# Altium schematic sheet 601_USBHub-Grid-Part1.SchDoc: USB Hub Grid Connections Part 1
size A2; Organization: Greenfield Tech Solutions; Address1: Molendreef 33; Address2: Ossendrecht; Address3: 4641CS; Address4: The Netherlands; SheetNumber: 7; SheetTotal: 9
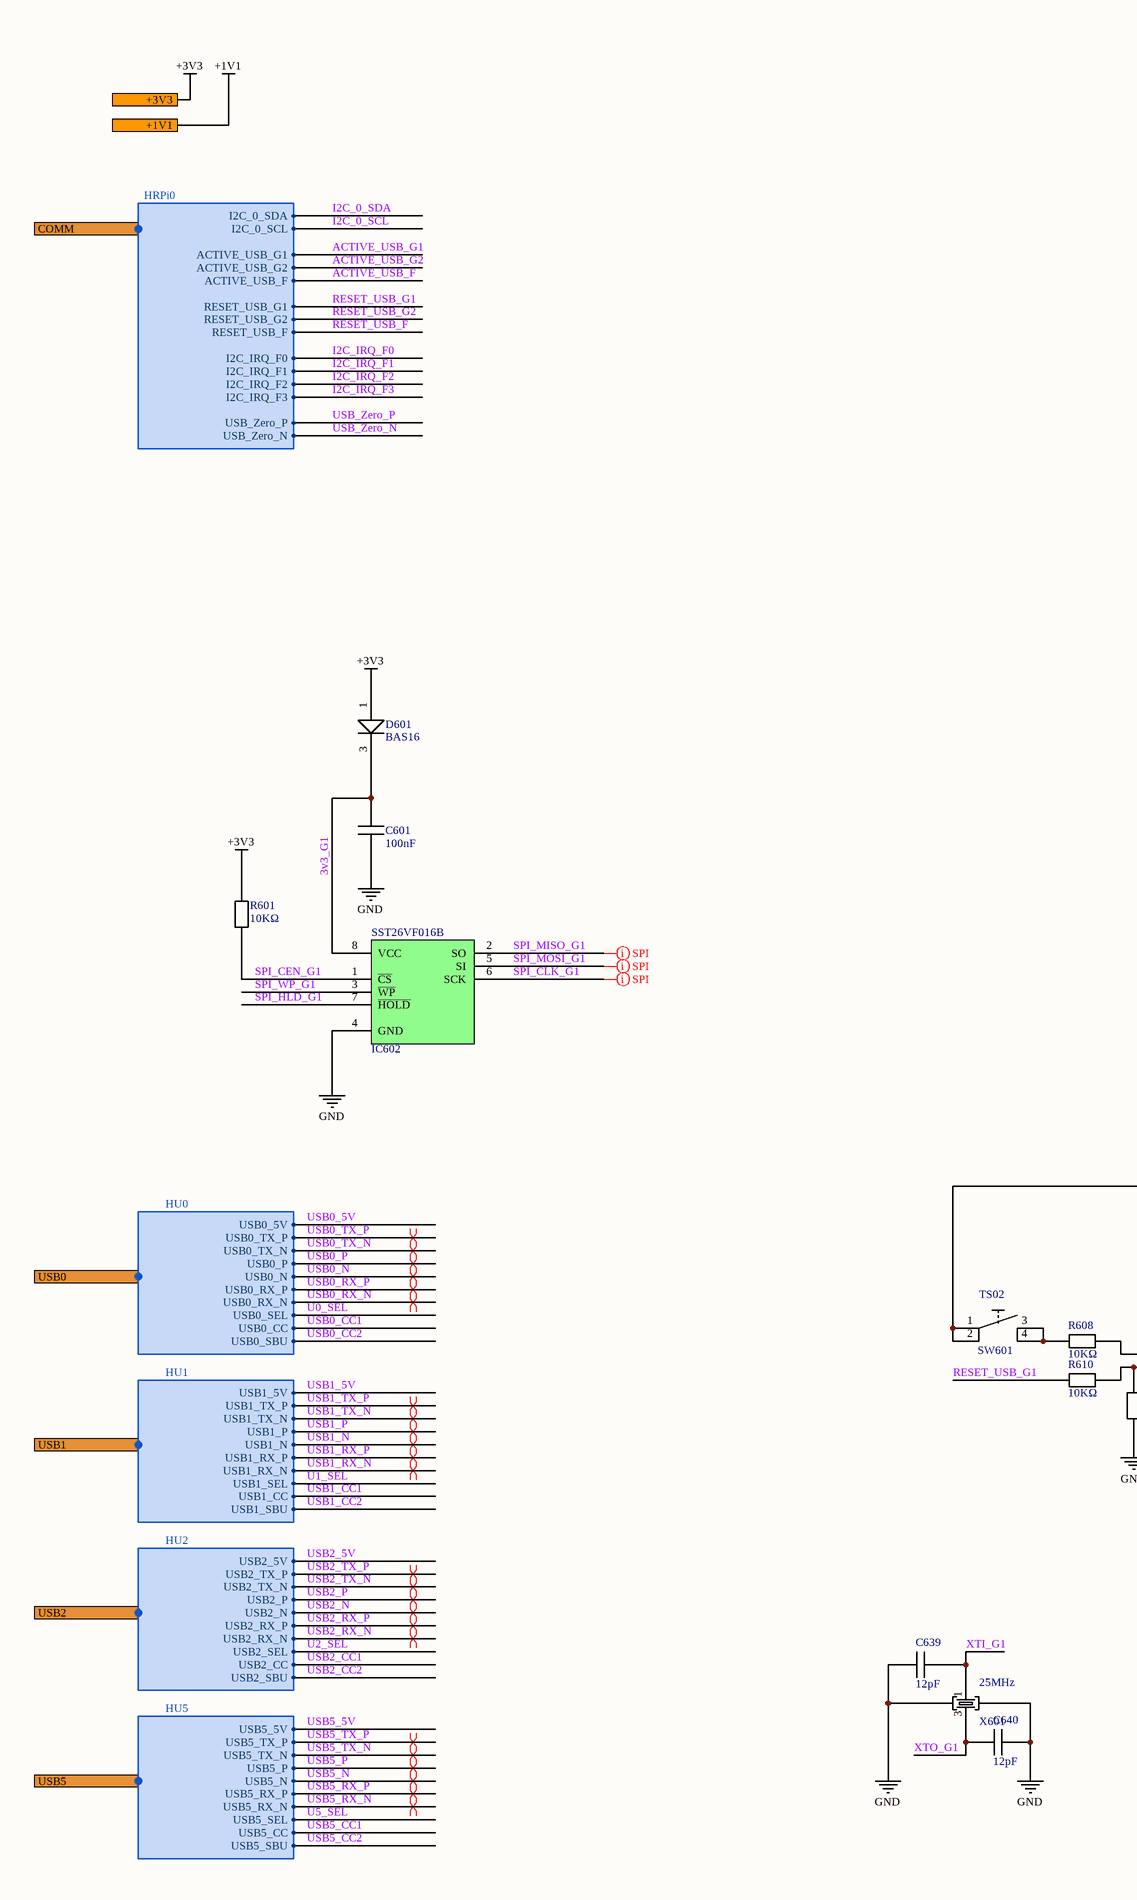
[diagram p0: 601_USBHub-Grid-Part1.SchDoc, left]
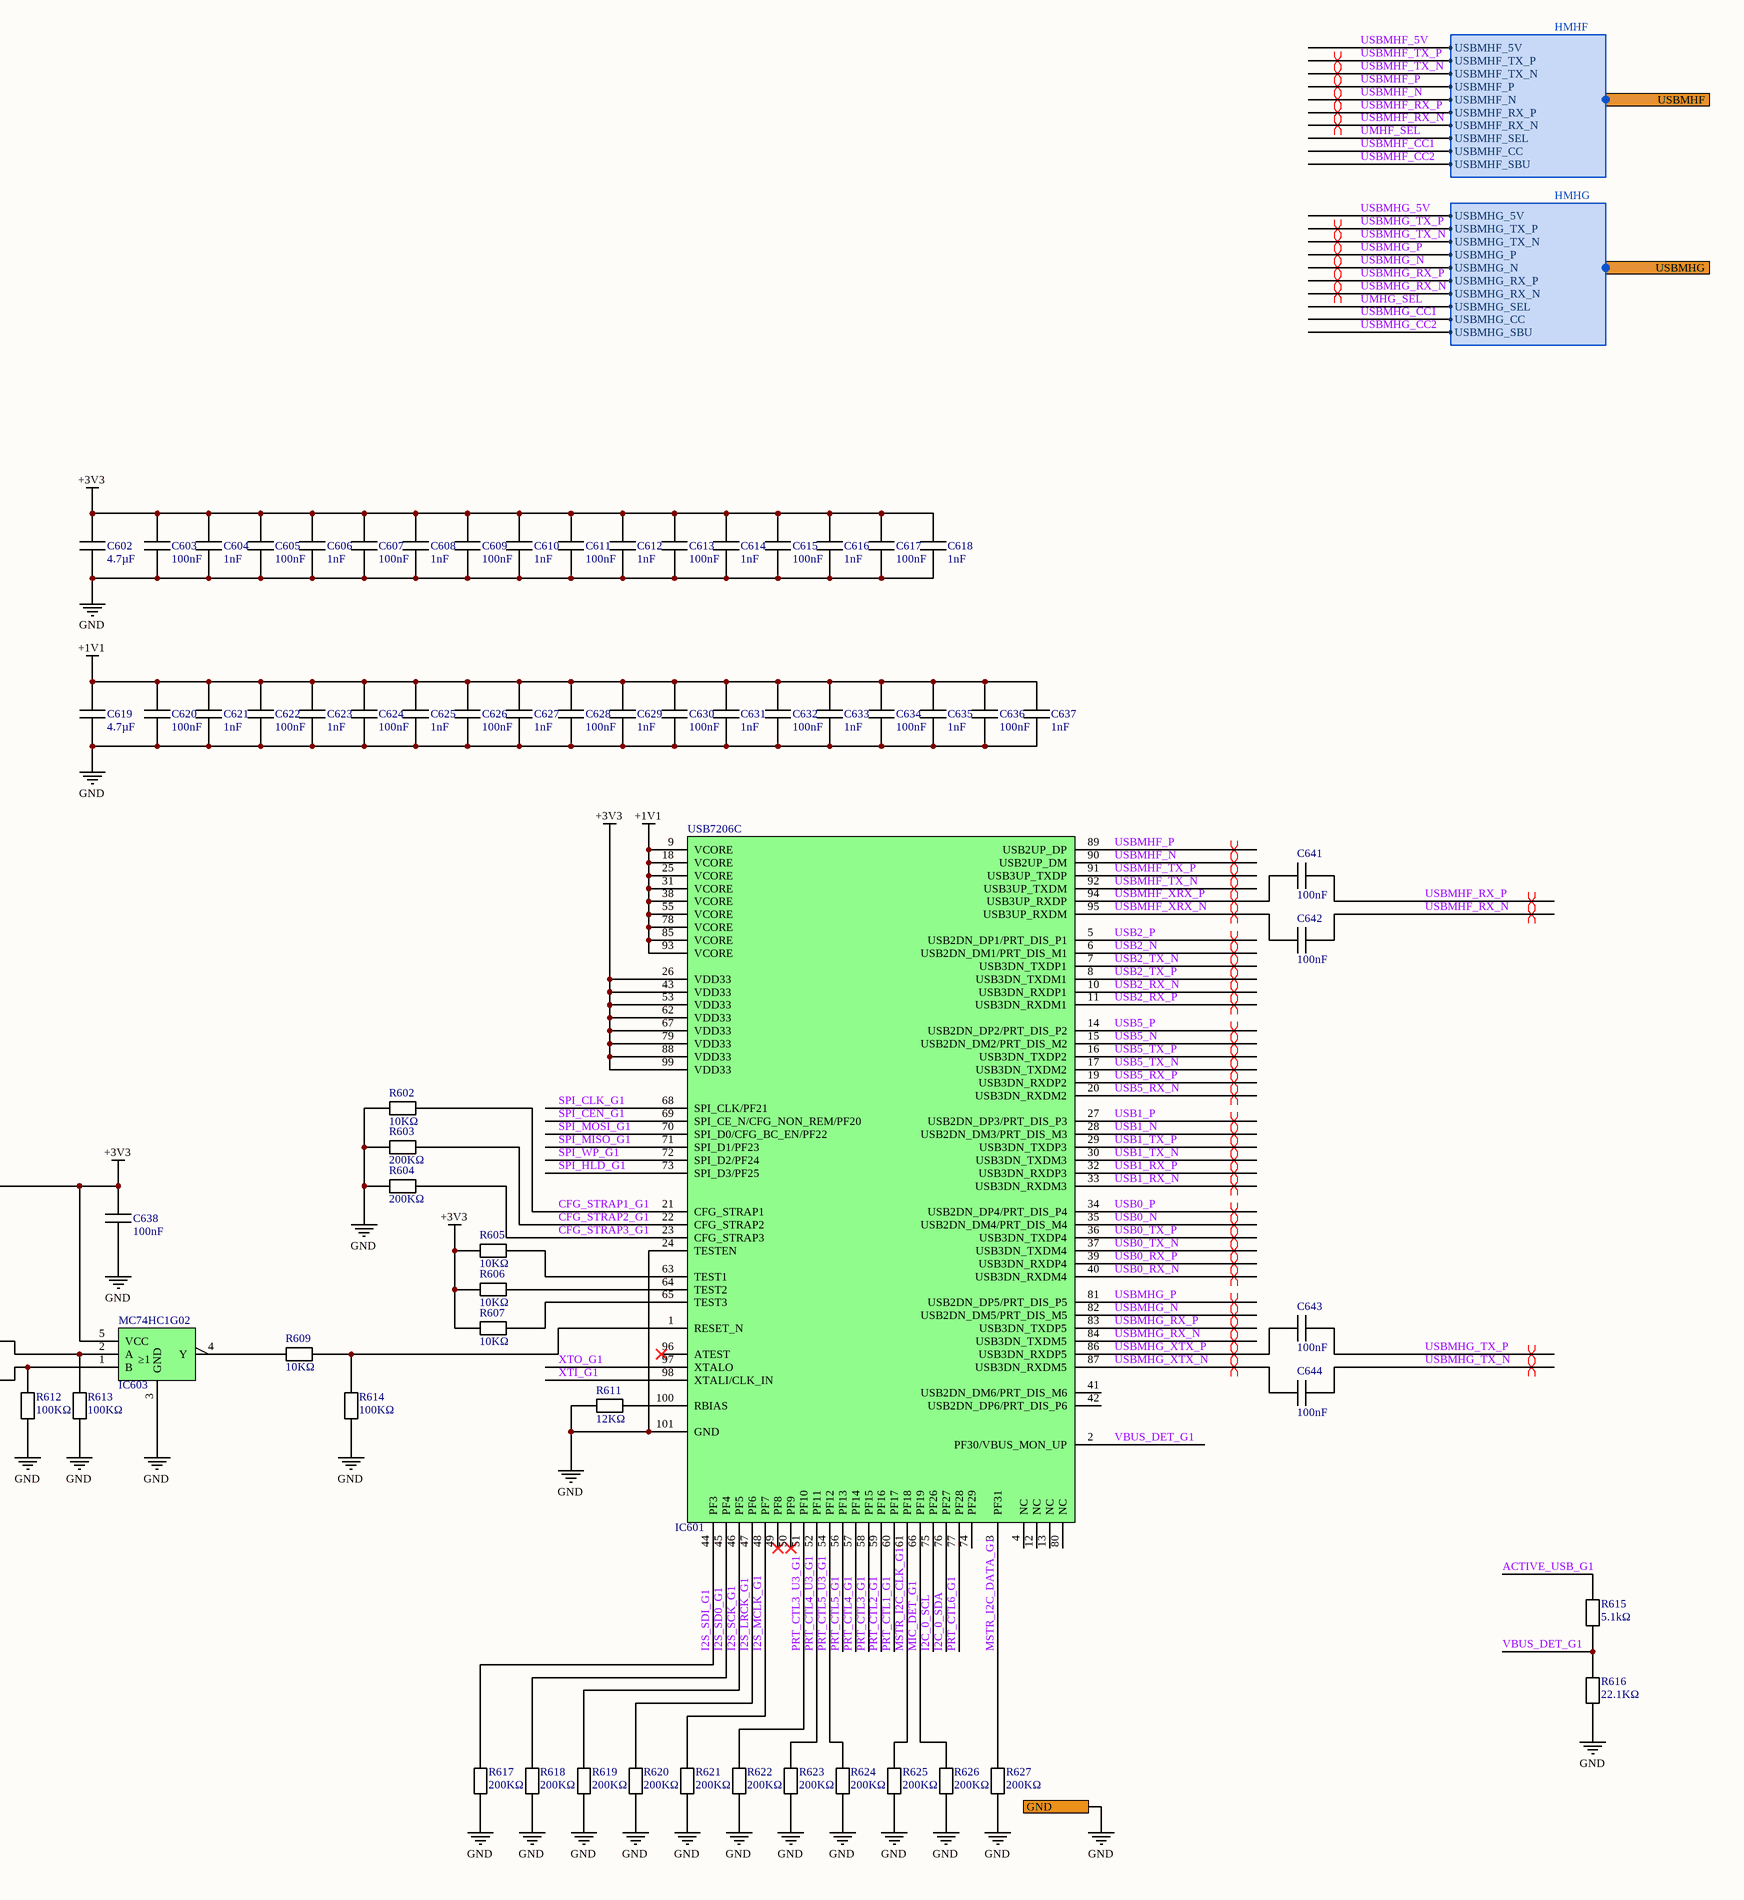
[diagram p1: 601_USBHub-Grid-Part1.SchDoc, right]

## Parts
C601  100nF  [C0402]
C602  4.7µF  [C0603]
C603  100nF  [C0402]
C604  1nF  [C0402]
C605  100nF  [C0402]
C606  1nF  [C0402]
C607  100nF  [C0402]
C608  1nF  [C0402]
C609  100nF  [C0402]
C610  1nF  [C0402]
C611  100nF  [C0402]
C612  1nF  [C0402]
C613  100nF  [C0402]
C614  1nF  [C0402]
C615  100nF  [C0402]
C616  1nF  [C0402]
C617  100nF  [C0402]
C618  1nF  [C0402]
C619  4.7µF  [C0603]
C620  100nF  [C0402]
C621  1nF  [C0402]
C622  100nF  [C0402]
C623  1nF  [C0402]
C624  100nF  [C0402]
C625  1nF  [C0402]
C626  100nF  [C0402]
C627  1nF  [C0402]
C628  100nF  [C0402]
C629  1nF  [C0402]
C630  100nF  [C0402]
C631  1nF  [C0402]
C632  100nF  [C0402]
C633  1nF  [C0402]
C634  100nF  [C0402]
C635  1nF  [C0402]
C636  100nF  [C0402]
C637  1nF  [C0402]
C638  100nF  [C0402]
C639  12pF  [C0402]
C640  12pF  [C0402]
C641  100nF  [C0402]
C642  100nF  [C0402]
C643  100nF  [C0402]
C644  100nF  [C0402]
D601  BAS16  [SOT-23]
IC601  USB7206C  [VQFN-100G_12X12]
IC602  SST26VF016B  [SO-8]
IC603  MC74HC1G02  [TSOP-5]
R601  10KΩ  [R0402]
R602  10KΩ  [R0402]
R603  200KΩ  [R0402]
R604  200KΩ  [R0402]
R605  10KΩ  [R0402]
R606  10KΩ  [R0402]
R607  10KΩ  [R0402]
R608  10KΩ  [R0402]
R609  10KΩ  [R0402]
R610  10KΩ  [R0402]
R611  12KΩ  [R0402]
R612  100KΩ  [R0402]
R613  100KΩ  [R0402]
R614  100KΩ  [R0402]
R615  5.1kΩ  [R0402]
R616  22.1KΩ  [R0603]
R617  200KΩ  [R0402]
R618  200KΩ  [R0402]
R619  200KΩ  [R0402]
R620  200KΩ  [R0402]
R621  200KΩ  [R0402]
R622  200KΩ  [R0402]
R623  200KΩ  [R0402]
R624  200KΩ  [R0402]
R625  200KΩ  [R0402]
R626  200KΩ  [R0402]
R627  200KΩ  [R0402]
SW601  TS02  [TS02]
X601  25MHz  [403W]

## Ports
+1V1, +3V3, COMM (harness HRPi0), GND, USB0 (harness HU0), USB1 (harness HU1), USB2 (harness HU2), USB5 (harness HU5), USBMHF (harness HMHF), USBMHG (harness HMHG)

## Harnesses
HU0: USB0_5V, USB0_TX_P, USB0_TX_N, USB0_N, USB0_RX_P, USB0_RX_N, USB0_SEL, USB0_P, USB0_CC, USB0_SBU
HU1: USB1_5V, USB1_TX_P, USB1_TX_N, USB1_N, USB1_RX_P, USB1_RX_N, USB1_SEL, USB1_P, USB1_CC, USB1_SBU
HU2: USB2_5V, USB2_TX_P, USB2_TX_N, USB2_N, USB2_RX_P, USB2_RX_N, USB2_SEL, USB2_P, USB2_CC, USB2_SBU
HMHF: USBMHF_5V, USBMHF_TX_P, USBMHF_TX_N, USBMHF_N, USBMHF_RX_P, USBMHF_RX_N, USBMHF_SEL, USBMHF_P, USBMHF_CC, USBMHF_SBU
HMHG: USBMHG_5V, USBMHG_TX_P, USBMHG_TX_N, USBMHG_N, USBMHG_RX_P, USBMHG_RX_N, USBMHG_SEL, USBMHG_P, USBMHG_CC, USBMHG_SBU
HU5: USB5_5V, USB5_TX_P, USB5_TX_N, USB5_N, USB5_RX_P, USB5_RX_N, USB5_SEL, USB5_P, USB5_CC, USB5_SBU
HRPi0: I2C_0_SCL, I2C_0_SDA, I2C_IRQ_F0, I2C_IRQ_F1, I2C_IRQ_F3, I2C_IRQ_F2, ACTIVE_USB_G1, ACTIVE_USB_F, ACTIVE_USB_G2, RESET_USB_G1, RESET_USB_F, RESET_USB_G2, USB_Zero_N, USB_Zero_P

## Nets
+1V1: C619.1 C620.1 C621.1 C622.1 C623.1 C624.1 C625.1 C626.1 C627.1 C628.1 C629.1 C630.1 C631.1 C632.1 C633.1 C634.1 C635.1 C636.1 C637.1 IC601.9(VCORE) IC601.18(VCORE) IC601.25(VCORE) IC601.31(VCORE) IC601.38(VCORE) IC601.55(VCORE) IC601.78(VCORE) IC601.85(VCORE) IC601.93(VCORE) ; port +1V1
+3V3: C602.1 C603.1 C604.1 C605.1 C606.1 C607.1 C608.1 C609.1 C610.1 C611.1 C612.1 C613.1 C614.1 C615.1 C616.1 C617.1 C618.1 C638.1 D601.1(A) IC601.26(VDD33) IC601.43(VDD33) IC601.53(VDD33) IC601.62(VDD33) IC601.67(VDD33) IC601.79(VDD33) IC601.88(VDD33) IC601.99(VDD33) IC603.5(VCC) R601.2 R605.1 R606.1 R607.1 SW601.1 SW601.2 ; port +3V3
GND: C601.2 C602.2 C603.2 C604.2 C605.2 C606.2 C607.2 C608.2 C609.2 C610.2 C611.2 C612.2 C613.2 C614.2 C615.2 C616.2 C617.2 C618.2 C619.2 C620.2 C621.2 C622.2 C623.2 C624.2 C625.2 C626.2 C627.2 C628.2 C629.2 C630.2 C631.2 C632.2 C633.2 C634.2 C635.2 C636.2 C637.2 C638.2 C639.1 C640.2 IC601.24(TESTEN) IC601.101(GND) IC602.4(GND) IC603.3(GND) R602.2 R603.1 R604.1 R611.1 R612.1 R613.1 R614.1 R616.1 R617.1 R618.1 R619.1 R620.1 R621.1 R622.1 R623.1 R624.1 R625.1 R626.1 R627.1 X601.2 X601.4 ; port GND
3v3_G1: C601.1 D601.3(K) IC602.8(VCC)
ACTIVE_USB_F: port COMM.ACTIVE_USB_F
ACTIVE_USB_G1: R615.2 ; port COMM.ACTIVE_USB_G1
ACTIVE_USB_G2: port COMM.ACTIVE_USB_G2
CFG_STRAP1_G1: IC601.21(CFG_STRAP1) R602.1
CFG_STRAP2_G1: IC601.22(CFG_STRAP2) R603.2
CFG_STRAP3_G1: IC601.23(CFG_STRAP3) R604.2
I2C_0_SCL: IC601.75(PF26) ; port COMM.I2C_0_SCL
I2C_0_SDA: IC601.76(PF27) ; port COMM.I2C_0_SDA
I2C_IRQ_F0: port COMM.I2C_IRQ_F0
I2C_IRQ_F1: port COMM.I2C_IRQ_F1
I2C_IRQ_F2: port COMM.I2C_IRQ_F2
I2C_IRQ_F3: port COMM.I2C_IRQ_F3
I2S_LRCK_G1: IC601.47(PF6) R620.2
I2S_MCLK_G1: IC601.48(PF7) R621.2
I2S_SCK_G1: IC601.46(PF5) R619.2
I2S_SD0_G1: IC601.45(PF4) R618.2
I2S_SDI_G1: IC601.44(PF3) R617.2
MIC_DET_G1: IC601.66(PF19) R626.2
MSTR_I2C_CLK_G1: IC601.61(PF18) R625.2
MSTR_I2C_DATA_G1: IC601.3(PF31) R627.2
PRT_CTL1_G1: IC601.60(PF17)
PRT_CTL2_G1: IC601.59(PF16)
PRT_CTL3_G1: IC601.58(PF15)
PRT_CTL3_U3_G1: IC601.51(PF10) R622.2
PRT_CTL4_G1: IC601.57(PF14)
PRT_CTL4_U3_G1: IC601.52(PF11) R623.2
PRT_CTL5_G1: IC601.56(PF13)
PRT_CTL5_U3_G1: IC601.54(PF12) R624.2
PRT_CTL6_G1: IC601.77(PF28)
RESET_USB_F: port COMM.RESET_USB_F
RESET_USB_G1: R610.2 ; port COMM.RESET_USB_G1
RESET_USB_G2: port COMM.RESET_USB_G2
SPI_CEN_G1: IC601.69(SPI_CE_N/CFG_NON_REM/PF20) IC602.1(~{CS}) R601.1
SPI_CLK_G1: IC601.68(SPI_CLK/PF21) IC602.6(SCK)
SPI_HLD_G1: IC601.73(SPI_D3/PF25) IC602.7(~{HOLD})
SPI_MISO_G1: IC601.71(SPI_D1/PF23) IC602.2(SO)
SPI_MOSI_G1: IC601.70(SPI_D0/CFG_BC_EN/PF22) IC602.5(SI)
SPI_WP_G1: IC601.72(SPI_D2/PF24) IC602.3(~{WP})
U0_SEL: port USB0.USB0_SEL
U1_SEL: port USB1.USB1_SEL
U2_SEL: port USB2.USB2_SEL
U5_SEL: port USB5.USB5_SEL
UMHF_SEL: port USBMHF.USBMHF_SEL
UMHG_SEL: port USBMHG.USBMHG_SEL
USB0_5V: port USB0.USB0_5V
USB0_CC1: port USB0.USB0_CC
USB0_CC2: port USB0.USB0_SBU
USB0_N: IC601.35(USB2DN_DM4/PRT_DIS_M4) ; port USB0.USB0_N
USB0_P: IC601.34(USB2DN_DP4/PRT_DIS_P4) ; port USB0.USB0_P
USB0_RX_N: IC601.40(USB3DN_RXDM4) ; port USB0.USB0_RX_N
USB0_RX_P: IC601.39(USB3DN_RXDP4) ; port USB0.USB0_RX_P
USB0_TX_N: IC601.37(USB3DN_TXDM4) ; port USB0.USB0_TX_N
USB0_TX_P: IC601.36(USB3DN_TXDP4) ; port USB0.USB0_TX_P
USB1_5V: port USB1.USB1_5V
USB1_CC1: port USB1.USB1_CC
USB1_CC2: port USB1.USB1_SBU
USB1_N: IC601.28(USB2DN_DM3/PRT_DIS_M3) ; port USB1.USB1_N
USB1_P: IC601.27(USB2DN_DP3/PRT_DIS_P3) ; port USB1.USB1_P
USB1_RX_N: IC601.33(USB3DN_RXDM3) ; port USB1.USB1_RX_N
USB1_RX_P: IC601.32(USB3DN_RXDP3) ; port USB1.USB1_RX_P
USB1_TX_N: IC601.30(USB3DN_TXDM3) ; port USB1.USB1_TX_N
USB1_TX_P: IC601.29(USB3DN_TXDP3) ; port USB1.USB1_TX_P
USB2_5V: port USB2.USB2_5V
USB2_CC1: port USB2.USB2_CC
USB2_CC2: port USB2.USB2_SBU
USB2_N: IC601.6(USB2DN_DM1/PRT_DIS_M1) ; port USB2.USB2_N
USB2_P: IC601.5(USB2DN_DP1/PRT_DIS_P1) ; port USB2.USB2_P
USB2_RX_N: IC601.10(USB3DN_RXDP1) ; port USB2.USB2_RX_N
USB2_RX_P: IC601.11(USB3DN_RXDM1) ; port USB2.USB2_RX_P
USB2_TX_N: IC601.7(USB3DN_TXDP1) ; port USB2.USB2_TX_N
USB2_TX_P: IC601.8(USB3DN_TXDM1) ; port USB2.USB2_TX_P
USB5_5V: port USB5.USB5_5V
USB5_CC1: port USB5.USB5_CC
USB5_CC2: port USB5.USB5_SBU
USB5_N: IC601.15(USB2DN_DM2/PRT_DIS_M2) ; port USB5.USB5_N
USB5_P: IC601.14(USB2DN_DP2/PRT_DIS_P2) ; port USB5.USB5_P
USB5_RX_N: IC601.20(USB3DN_RXDM2) ; port USB5.USB5_RX_N
USB5_RX_P: IC601.19(USB3DN_RXDP2) ; port USB5.USB5_RX_P
USB5_TX_N: IC601.17(USB3DN_TXDM2) ; port USB5.USB5_TX_N
USB5_TX_P: IC601.16(USB3DN_TXDP2) ; port USB5.USB5_TX_P
USB_Zero_N: port COMM.USB_Zero_N
USB_Zero_P: port COMM.USB_Zero_P
USBMHF_5V: port USBMHF.USBMHF_5V
USBMHF_CC1: port USBMHF.USBMHF_CC
USBMHF_CC2: port USBMHF.USBMHF_SBU
USBMHF_N: IC601.90(USB2UP_DM) ; port USBMHF.USBMHF_N
USBMHF_P: IC601.89(USB2UP_DP) ; port USBMHF.USBMHF_P
USBMHF_RX_N: C642.2 ; port USBMHF.USBMHF_RX_N
USBMHF_RX_P: C641.2 ; port USBMHF.USBMHF_RX_P
USBMHF_TX_N: IC601.92(USB3UP_TXDM) ; port USBMHF.USBMHF_TX_N
USBMHF_TX_P: IC601.91(USB3UP_TXDP) ; port USBMHF.USBMHF_TX_P
USBMHF_XRX_N: C642.1 IC601.95(USB3UP_RXDM)
USBMHF_XRX_P: C641.1 IC601.94(USB3UP_RXDP)
USBMHG_5V: port USBMHG.USBMHG_5V
USBMHG_CC1: port USBMHG.USBMHG_CC
USBMHG_CC2: port USBMHG.USBMHG_SBU
USBMHG_N: IC601.82(USB2DN_DM5/PRT_DIS_M5) ; port USBMHG.USBMHG_N
USBMHG_P: IC601.81(USB2DN_DP5/PRT_DIS_P5) ; port USBMHG.USBMHG_P
USBMHG_RX_N: IC601.84(USB3DN_TXDM5) ; port USBMHG.USBMHG_RX_N
USBMHG_RX_P: IC601.83(USB3DN_TXDP5) ; port USBMHG.USBMHG_RX_P
USBMHG_TX_N: C644.2 ; port USBMHG.USBMHG_TX_N
USBMHG_TX_P: C643.2 ; port USBMHG.USBMHG_TX_P
USBMHG_XTX_N: C644.1 IC601.87(USB3DN_RXDM5)
USBMHG_XTX_P: C643.1 IC601.86(USB3DN_RXDP5)
VBUS_DET_G1: IC601.2(PF30/VBUS_MON_UP) R615.1 R616.2
XTI_G1: C639.2 IC601.98(XTALI/CLK_IN) X601.1
XTO_G1: C640.1 IC601.97(XTALO) X601.3
NetIC601_1: IC601.1(RESET_N) R609.2 R614.2
NetIC601_63: IC601.63(TEST1) R605.2
NetIC601_64: IC601.64(TEST2) R606.2
NetIC601_65: IC601.65(TEST3) R607.2
NetIC601_100: IC601.100(RBIAS) R611.2
NetIC603_1: IC603.1(B) R610.1 R612.2
NetIC603_2: IC603.2(A) R608.1 R613.2
NetIC603_4: IC603.4(Y) R609.1
NetR608_2: R608.2 SW601.3 SW601.4

Not connected (* = marked no-connect by the designer): IC601 4(NC) 12(NC) 13(NC) 41(USB2DN_DM6/PRT_DIS_M6) 42(USB2DN_DP6/PRT_DIS_P6) 49(PF8)* 50(PF9)* 74(PF29) 80(NC) 96(ATEST)*

## Layout directives
differential pair; differential pair class USB3: USB0_N, USB0_P, USB0_RX_N, USB0_RX_P, USB0_TX_N, USB0_TX_P, USB1_N, USB1_P, USB1_RX_N, USB1_RX_P, USB1_TX_N, USB1_TX_P, USB2_N, USB2_P, USB2_RX_N, USB2_RX_P, USB2_TX_N, USB2_TX_P, USB5_N, USB5_P, USB5_RX_N, USB5_RX_P, USB5_TX_N, USB5_TX_P, USBMHF_N, USBMHF_P, USBMHF_RX_N, USBMHF_RX_P, USBMHF_TX_N, USBMHF_TX_P, USBMHF_XRX_N, USBMHF_XRX_P, USBMHG_N, USBMHG_P, USBMHG_RX_N, USBMHG_RX_P, USBMHG_TX_N, USBMHG_TX_P, USBMHG_XTX_N, USBMHG_XTX_P
net class SPI_GRID1: SPI_CLK_G1, SPI_MISO_G1, SPI_MOSI_G1

## Notes on the sheet
- Title
- Size:
- Date:
- File:
- A2
- Number:
- Time:
- Revision:
- Sheet
- of
- (in symbol IC0061) ≥1

## Library data of the parts
C601 C603 C605 C607 C609 C611 C613 C615 C617 C620 C622 C624 C626 C628 C630 C632 C634 C636 C638 C641-C644 = CA0010: 100nF 16V 10% X7R; Part Number: CA0010; ManfactPart: GCM155R71C104KA55D; ID: 10; RefVal: 100nF
C602 C619 = CA0002: 4.7µF 16V 10% X5R; Part Number: CA0002; ManfactPart: C1608X5R1C475K080AC; ID: 2; RefVal: 4.7µF
C604 C606 C608 C610 C612 C614 C616 C618 C621 C623 C625 C627 C629 C631 C633 C635 C637 = CA0031: 1nF 50V 1% C0G; Part Number: CA0031; ManfactPart: GRT1555C1H102FA02D; ID: 31; RefVal: 1nF
C639 C640 = CA0059: 12pF 16V 1% C0G; Part Number: CA0059; ManfactPart: VJ0402A120FXJCW1BC; ID: 59; RefVal: 12pF
D601 = DI0010: Diodes - General Purpose, Power, Switching 100Vll Signal Switching Diodes 2A; Part Number: DI0010; ManfactPart: BAS16_R1_00001; ID: 10; RefVal: BAS16
IC601 = IC0065: 6-Port USB 3.2 Gen 2 Controller Hub; Part Number: IC0065; ID: 65; RefVal: USB7206C; ManfactPart: USB7206C
IC602 = IC0059: 16 Mbit Serial Quad I/O (SQI) Flash Memory; Part Number: IC0059; ManfactPart: SST26VF016B-104I/SM; ID: 59; RefVal: SST26VF016B
IC603 = IC0061: Logic Gates 2-6V Single 2-Input NOR; Part Number: IC0061; ManfactPart: MC74HC1G02DTT1G; ID: 61; RefVal: MC74HC1G02
R601 R602 R605-R610 = RS0011: 10KΩ 1% 62.5mW; Part Number: RS0011; ManfactPart: WR04X1002FTL; ID: 11; RefVal: 10KΩ
R603 R604 R617-R627 = RS0045: 200KΩ 1% 62.5mW 100PPM; Part Number: RS0045; ManfactPart: CRG0402F200K; ID: 45; RefVal: 200KΩ
R611 = RS0015: 12KΩ 1% 62.5mW; Part Number: RS0015; ManfactPart: RC0402FR-1312KL; ID: 15; RefVal: 12KΩ
R612-R614 = RS0036: 100KΩ 1% 62.5mW 100PPM; Part Number: RS0036; ManfactPart: AC0402FR-13100KL; ID: 36; RefVal: 100KΩ
R615 = RS0038: 5.1KΩ 1% 62.5mW 100PPM; Part Number: RS0038; ManfactPart: CRCW04025K10FKEDC; ID: 38; RefVal: 5.1kΩ
R616 = RS0040: 22.1KΩ 1% 100mW 100PPM; Part Number: RS0040; ManfactPart: RC0603FR-0722K1L; ID: 40; RefVal: 22.1KΩ
SW601 = SW0005: TACTILE SWITCH SPST; Part Number: SW0005; ManfactPart: TS02-66-50-BK-160-SCR-D; ID: 5; RefVal: TS02
X601 = CR0003: 25MHz 8pF 20PPM; Part Number: CR0003; ManfactPart: 403WF25012IK; ID: 3; RefVal: 25MHz